# EAGLE design A-BRIDGE (EAGLE 7.6.0)
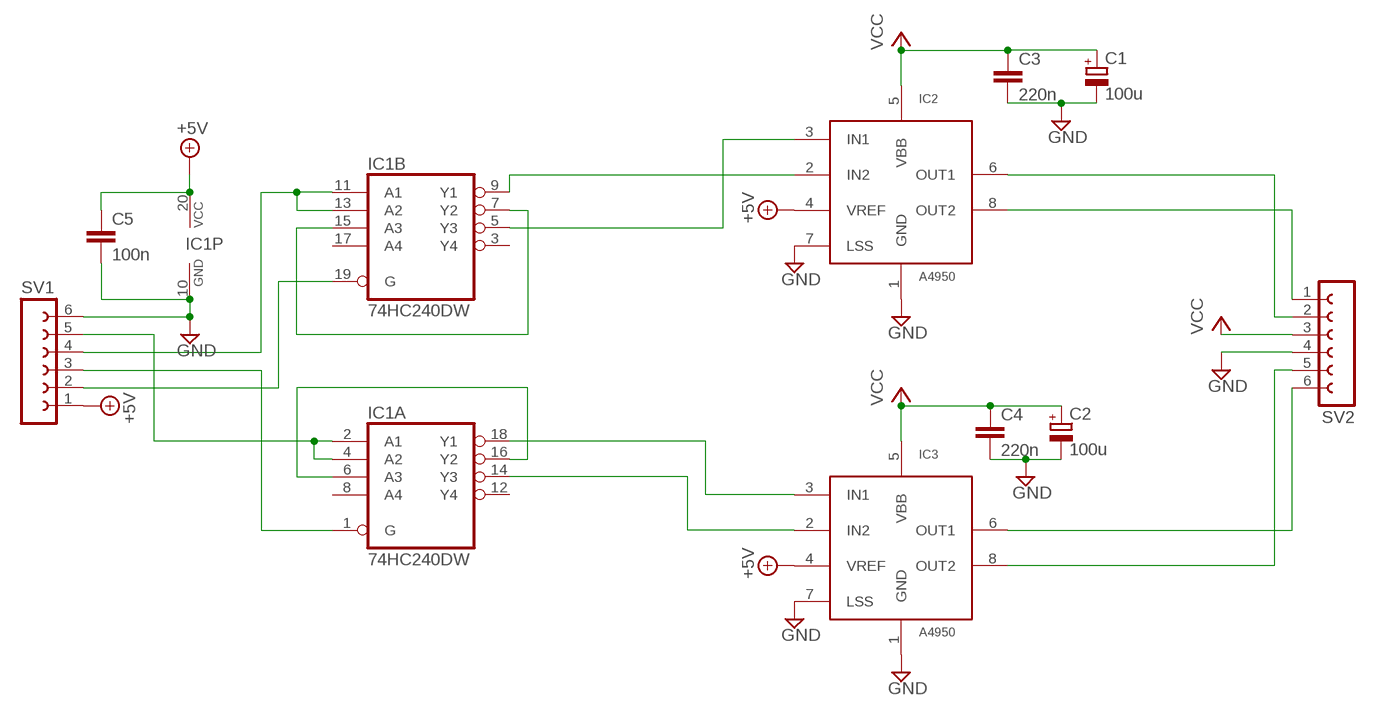
[diagram p0: schematic, sheet 1]

## Parts
C1  100u  CPOL-EUUD-6,3X7,7-HS  [UD-6,3X7,7_NICHICON_HS]
C2  100u  CPOL-EUUD-6,3X7,7-HS  [UD-6,3X7,7_NICHICON_HS]
C3  220n  C-EUC0805K  [C0805K]
C4  220n  C-EUC0805K  [C0805K]
C5  100n  C-EUC1206K  [C1206K]
IC1  74HC240DW  [SO20W]
IC2  A4950  [SOICN-8]
IC3  A4950  [SOICN-8]
SV1  FE06-1  [FE06]
SV2  FE06-1  [FE06]

## Nets
+5V: C5.1 IC1.20(P:VCC) IC2.4(VREF) IC3.4(VREF) SV1.1
GND: C1.- C2.- C3.2 C4.2 C5.2 IC1.10(P:GND) IC2.1(GND) IC2.7(LSS) IC3.1(GND) IC3.7(LSS) SV1.6 SV2.4
N$4: IC2.6(OUT1) SV2.2
N$5: IC2.8(OUT2) SV2.1
N$6: IC3.6(OUT1) SV2.6
N$7: IC3.8(OUT2) SV2.5
N$8: IC1.14(A:Y3) IC3.2(IN2)
N$9: IC1.18(A:Y1) IC3.3(IN1)
N$10: IC1.6(A:A3) IC1.16(A:Y2)
N$11: IC1.2(A:A1) IC1.4(A:A2) SV1.5
N$12: IC1.11(B:A1) IC1.13(B:A2) SV1.4
N$13: IC1.7(B:Y2) IC1.15(B:A3)
N$14: IC1.9(B:Y1) IC2.2(IN2)
N$15: IC1.5(B:Y3) IC2.3(IN1)
N$16: IC1.1(A:G) SV1.3
N$17: IC1.19(B:G) SV1.2
VCC: C1.+ C2.+ C3.1 C4.1 IC2.5(VBB) IC3.5(VBB) SV2.3
Unconnected: IC1.3(B:Y4) IC1.8(A:A4) IC1.12(A:Y4) IC1.17(B:A4)

## Library data of the parts
C1 C2 = rcl:CPOL-EU: POLARIZED CAPACITOR, European symbol
C3-C5 = rcl:C-EU: CAPACITOR, European symbol
IC1 = 74xx-eu:74*240: Octal BUFFER and LINE DRIVER, 3-state
IC2 IC3 = Tolomei_s:A4950: Allegro Motor driver 3.5A
SV1 SV2 = con-lsta:FE06-1: FEMALE HEADER; OC_FARNELL: unknown; OC_NEWARK: unknown

## Board
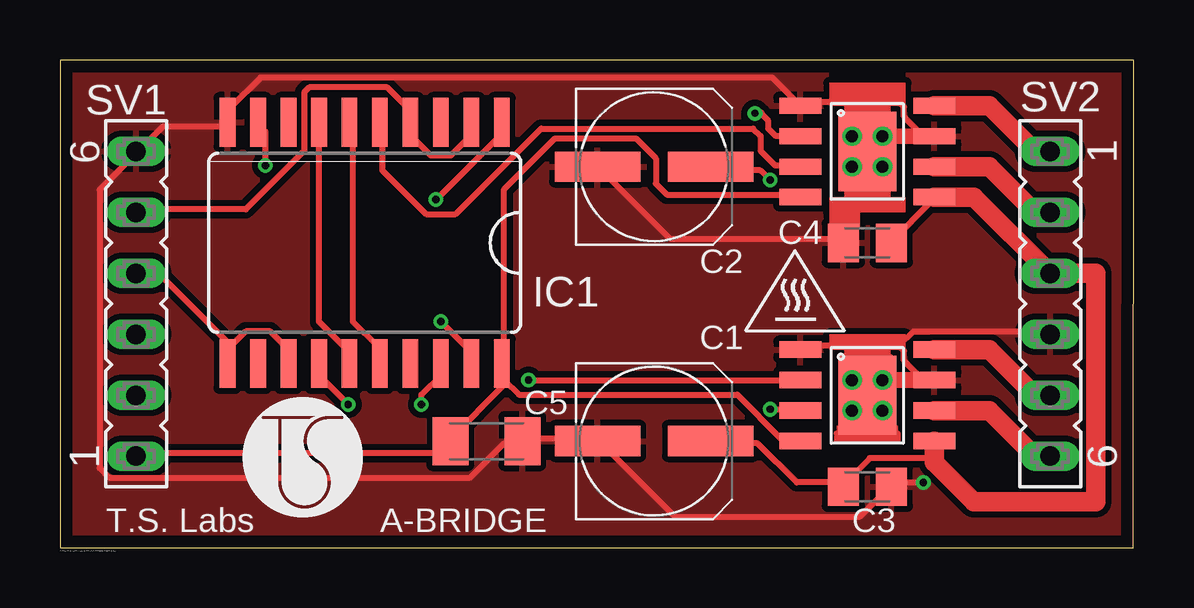
[diagram p1: board, top side]
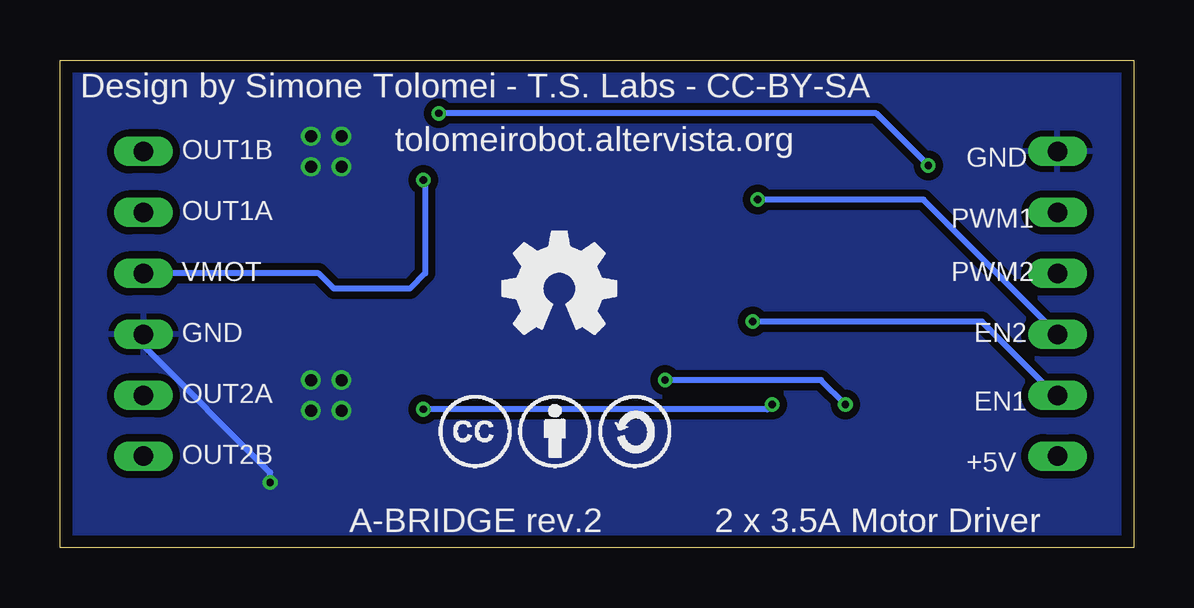
[diagram p2: board, bottom side, seen from below]

Size 44.75 x 20.32 mm. Coordinates in mm from the lower left corner, seen from the top.
Outline: 0,0 44.73,0 44.76,20.32 0,20.32 0,0
Copper layers (1*16): Top 0.035mm / dielectric 1.6mm / Bottom 0.035mm
Design rules "Elecrow_2-layer_PCB_eagle_rule *": minimum track width 10mil, minimum drill 12mil, track to track 6mil, track to pad 6mil, pad to pad 6mil, via to via 8mil, smd to smd 0mil, copper to edge 20mil, drill to drill 10mil, minimum pad ring 6mil, minimum via ring 6mil, stop-mask expansion 0mil, vias tented up to drill 100mil, thermal gap 10mil

### Footprints (pad centres in the part's own frame; a part is rotated, then mirrored left to right if it is on the bottom)
UD-6,3X7,7_NICHICON_HS = smd 3.562 x 1.254: + 2.35,0; - -2.35,0
C0805K = smd 1.3 x 1.6: 1 -1,0; 2 1,0
C1206K = smd 1.5 x 2: 1 -1.5,0; 2 1.5,0
SO20W = smd 0.66 x 2.032: 1 -5.715,-5.029; 2 -4.445,-5.029; 3 -3.175,-5.029; 4 -1.905,-5.029; 5 -0.635,-5.029; 6 0.635,-5.029; 7 1.905,-5.029; 8 3.175,-5.029; 9 4.445,-5.029; 10 5.715,-5.029; 11 5.715,5.029; 12 4.445,5.029; 13 3.175,5.029; 14 1.905,5.029; 15 0.635,5.029; 16 -0.635,5.029; 17 -1.905,5.029; 18 -3.175,5.029; 19 -4.445,5.029; 20 -5.715,5.029
SOICN-8 = smd 0.68 x 1.75: 1 -1.905,-2.8; 2 -0.635,-2.8; 3 0.635,-2.8; 4 1.905,-2.8; 5 1.905,2.8; 6 0.635,2.8; 7 -0.635,2.8; 8 -1.905,2.8 | smd 3.3 x 2.41: P$9 0,0
FE06 = drill 0.813 long: 1 -6.35,0; 2 -3.81,0; 3 -1.27,0; 4 1.27,0; 5 3.81,0; 6 6.35,0

### Placement (x,y rotation side)
C1  24.77,4.45 0 top
C2  24.77,15.88 0 top
C3  33.66,2.54 0 top
C4  33.66,12.7 180 top
C5  17.78,4.45 0 top
IC1  12.7,12.7 180 top
IC2  33.66,16.51 270 top
IC3  33.66,6.35 270 top
SV1  3.17,10.16 90 top
SV2  41.27,10.16 270 top

### Tracks (layer width: path | path; a pad name or v marks a point on that pad's centre or on a via)
+5V
  Top 0.254: 18.52,6.99 19.13,6.38 28.23,6.38 30.06,4.55 30.71,4.55 IC3.4 | 18.52,6.99 18.52,7.59 IC1.20 | IC2.4 30.71,14.71 25.3,14.71 24.84,15.16 24.84,16.22 24,17.06 20.64,17.06 18.52,14.94 18.52,7.8 IC1.20 | 18.52,6.99 18.52,6.78 16.28,4.55 C5.1 16.08,4.34 15.67,3.94 3.28,3.94 SV1.1 | 18.52,6.99 IC1.20
GND  (via drill 0.3, 0.5)
  Top 0.254: 34.98,8.41 30.91,8.41 IC3.1 | 34.98,8.41 35.18,8.2 35.18,7.8 35.99,6.99 IC3.7 | 34.98,8.41 35.59,9.02 41.27,9.02 SV2.4 | 19.33,4.55 22.38,4.55 C1.- 22.58,4.34 25.63,1.29 33.35,1.29 34.57,2.52 C3.2 34.77,2.72 v35.99,2.72 | 6.93,17.55 4.29,17.55 3.28,16.54 SV1.6 3.07,16.33 1.65,14.91 1.65,3.33 2.06,2.92 17.09,2.92 18.52,4.34 19.13,4.34 | IC2.7 35.99,17.14 35.18,17.96 35.18,18.36 34.98,18.57 30.91,18.57 IC2.1 30.71,18.57 29.69,19.58 8.36,19.58 7.14,18.36 7.14,17.75 | C4.2 32.54,12.88 25.43,12.88 22.58,15.72 C2.-
  Bottom 0.254: SV2.4 41.27,8.41 35.99,3.12 v35.99,2.72
  other vias: 33.02,15.88 33.02,6.99 34.29,6.99 34.29,17.14 33.02,5.71 34.29,5.71 34.29,15.88 33.02,17.14
  pour Top (isolate 0.254): 0,0 44.45,0 44.45,20.32 0,20.32
  pour Bottom (isolate 0.305): 0,0 44.75,0 44.75,20.32 0,20.32
N$1
  Top 0.254: 32.38,4.76 32.38,4.45 34.92,4.45 34.92,4.76 32.38,4.76
N$2
  Top 0.254: 34.61,7.94 34.29,8.26 33.02,8.26 32.7,7.94 34.61,7.94
N$4
  Top 0.813: SV2.2 40.64,13.97 38.73,15.88 IC2.6
N$5
  Top 0.813: SV2.1 40.64,16.51 38.73,18.41 IC2.8
N$6
  Top 0.813: SV2.6 40.64,3.81 38.73,5.71 IC3.6
N$7
  Top 0.813: SV2.5 40.64,6.35 38.73,8.26 IC3.8
N$8  (via drill 0.3)
  Top 0.254: v19.53,6.99 IC3.2 | v12.01,5.97 10.79,7.19 IC1.14
  Bottom 0.254: v19.53,6.99 13.03,6.99 v12.01,5.97
N$9  (via drill 0.3)
  Top 0.254: v29.6,5.77 30.71,5.77 IC3.3 | v15.06,5.97 15.06,6.38 15.88,7.19 IC1.18
  Bottom 0.254: v29.6,5.77 15.27,5.77 v15.06,5.97
N$10
  Top 0.254: IC1.6 12.22,17.55 12.22,9.42 13.23,8.41 13.23,7.8 IC1.16
N$11
  Top 0.254: IC1.2 17.09,17.55 17.09,17.14 16.28,16.33 15.47,16.33 14.66,17.14 14.66,17.55 IC1.4 14.45,17.75 14.45,18.36 13.64,19.18 10.39,19.18 10.19,18.97 10.19,16.54 7.75,14.1 3.28,14.1 SV1.5
N$12
  Top 0.254: 7.14,8.41 7.14,7.8 IC1.11 7.14,8.41 | 7.14,8.41 7.75,9.02 8.76,9.02 9.37,8.41 9.37,7.8 IC1.13 | 7.14,8.41 4.29,11.25 3.28,11.25 SV1.4
N$13
  Top 0.254: IC1.7 10.79,9.42 12.01,8.2 12.01,7.8 IC1.15
N$14  (via drill 0.3)
  Top 0.254: v8.56,15.93 8.56,17.35 8.36,17.55 IC1.9 | 29.21,18.1 29.53,17.78 29.53,17.46 29.84,17.14 IC2.2
  Top 0.305: v28.97,18.1 29.21,18.1
  Bottom 0.254: v28.97,18.1 10.73,18.1 v8.56,15.93
N$15
  Top 0.254: IC2.3 30.71,15.93 29.81,15.93 29.21,16.52 29.21,17.14 28.89,17.46 20.05,17.46 16.48,13.89 15.27,13.89 13.44,15.72 13.44,17.55 IC1.5
N$16  (via drill 0.3)
  Top 0.254: v15.67,14.5 18.31,17.14 18.31,17.55 IC1.1
  Bottom 0.254: v15.67,14.5 8.76,14.5 3.28,9.02 SV1.3
N$17  (via drill 0.3)
  Top 0.254: v15.88,9.42 17.09,8.2 17.09,7.8 IC1.19
  Bottom 0.254: v15.88,9.42 6.33,9.42 3.28,6.38 SV1.2
VCC  (via drill 0.3)
  Top 0.254: 36.45,3.55 36.2,3.73 33.76,3.73 32.74,2.72 C3.1 32.54,2.72 30.71,2.72 29.08,4.34 27.25,4.34 C1.+ | C4.1 34.77,12.88 36.2,14.3 IC2.5 | C2.+ 27.25,15.72 29.2,15.72 v29.6,15.32
  Top 0.813: IC2.5 38.1,14.61 SV2.3 43.18,11.43 43.18,1.91 38.1,1.91 36.45,3.55 IC3.5
  Bottom 0.254: v29.6,15.32 29.53,15.32 29.53,11.43 30.16,10.79 33.34,10.79 33.97,11.43 SV2.3
(copper drawn outside any net)
  shapes: Top area x12

### Text on the board
tPlace: C:/Users/Simone/Documents/TSLabs/LOGO/logo_BTMAP_BW.bmp | C:/Users/Simone/Documents/TSLabs/LOGO/Altri/5041(Hot).bmp
bPlace: GND | OUT1B | OUT1A | PWM1 | PWM2 | VMOT | EN2 | GND | EN1 | OUT2A | +5V | OUT2B | A-BRIDGE rev.2
tNames: T.S. Labs | A-BRIDGE
bNames: Design by Simone Tolomei - T.S. Labs - CC-BY-SA | tolomeirobot.altervista.org | 2 x 3.5A Motor Driver